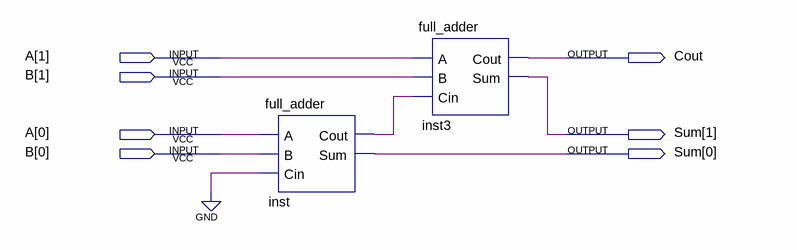
[diagram p0: schematic sheet]
// Quartus schematic cra2.bdf as structural Verilog: 2 symbols, 7 pins
module cra2 (
  input  [1:0] A,
  input  [1:0] B,
  output Cout,
  output [1:0] Sum
);

  wire inst_cout;

  full_adder inst (.A(A[0]), .B(B[0]), .Cin(1'b0), .Cout(inst_cout), .Sum(Sum[0]));
  full_adder inst3 (.A(A[1]), .B(B[1]), .Cin(inst_cout), .Cout(Cout), .Sum(Sum[1]));
endmodule
